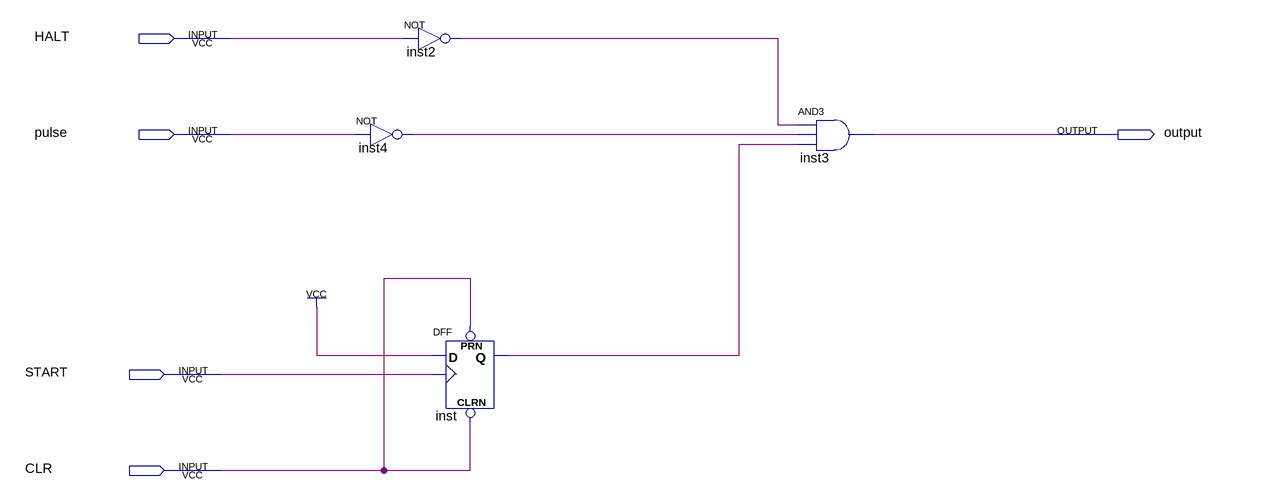
[diagram p0: schematic sheet]
// Quartus schematic My_Starter.bdf as structural Verilog: 4 symbols, 5 pins
module My_Starter (
  input  HALT,
  input  pulse,
  input  START,
  input  CLR,
  output \output 
);

  wire inst2_out, inst4_out, inst_q;

  not inst4 (inst4_out, pulse);
  not inst2 (inst2_out, HALT);
  DFF inst (.CLRN(CLR), .CLK(START), .D(1'b1), .PRN(CLR), .Q(inst_q));
  and inst3 (\output , inst2_out, inst4_out, inst_q);
endmodule
